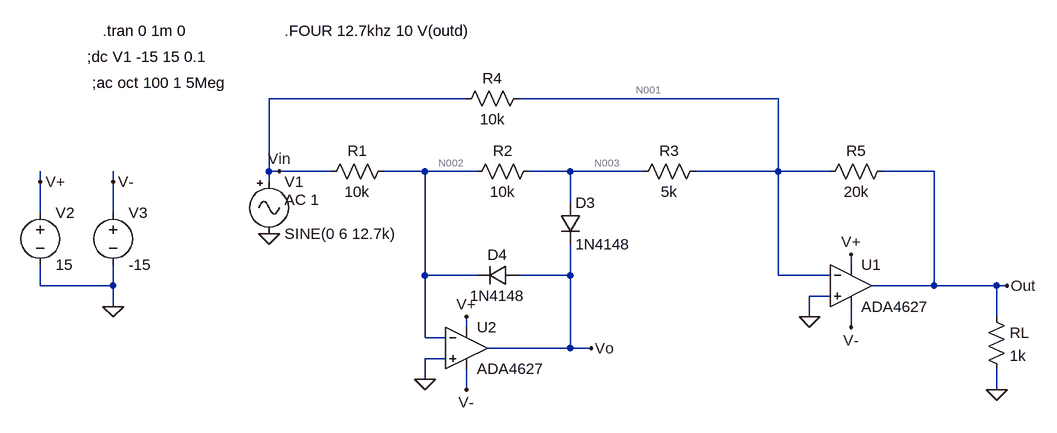
[diagram p0: schematic redresor.asc]
redresor.asc, the LTspice schematic file:
Version 4
SHEET 1 956 680
WIRE 0 -416 -304 -416
WIRE 480 -416 80 -416
WIRE -304 -304 -304 -416
WIRE -288 -304 -304 -304
WIRE -208 -304 -288 -304
WIRE -64 -304 -128 -304
WIRE 16 -304 -64 -304
WIRE 160 -304 96 -304
WIRE 272 -304 160 -304
WIRE 480 -304 480 -416
WIRE 480 -304 352 -304
WIRE 560 -304 480 -304
WIRE 720 -304 640 -304
WIRE -656 -288 -656 -304
WIRE -544 -288 -544 -304
WIRE -304 -288 -304 -304
WIRE 160 -256 160 -304
WIRE -656 -240 -656 -288
WIRE -544 -240 -544 -288
WIRE 592 -160 592 -176
WIRE -64 -144 -64 -304
WIRE 16 -144 -64 -144
WIRE 160 -144 160 -192
WIRE 160 -144 80 -144
WIRE 480 -144 480 -304
WIRE 560 -144 480 -144
WIRE -656 -128 -656 -160
WIRE -544 -128 -544 -160
WIRE -544 -128 -656 -128
WIRE 720 -128 720 -304
WIRE 720 -128 624 -128
WIRE 816 -128 720 -128
WIRE 832 -128 816 -128
WIRE 560 -112 528 -112
WIRE -544 -96 -544 -128
WIRE 528 -80 528 -112
WIRE 816 -80 816 -128
WIRE 0 -64 0 -80
WIRE 592 -64 592 -96
WIRE -64 -48 -64 -144
WIRE -32 -48 -64 -48
WIRE 160 -32 160 -144
WIRE 160 -32 32 -32
WIRE 192 -32 160 -32
WIRE -32 -16 -64 -16
WIRE -64 16 -64 -16
WIRE 0 32 0 0
WIRE 816 32 816 0
FLAG 832 -128 Out
FLAG -544 -96 0
FLAG -656 -288 V+
FLAG -544 -288 V-
FLAG 592 -176 V+
FLAG 592 -64 V-
FLAG 816 32 0
FLAG -64 16 0
FLAG 192 -32 Vo
FLAG 0 -80 V+
FLAG 0 32 V-
FLAG 528 -80 0
FLAG -288 -304 Vin
FLAG -304 -208 0
SYMBOL voltage -656 -256 R0
WINDOW 123 0 0 Left 2
WINDOW 39 0 0 Left 2
SYMATTR InstName V2
SYMATTR Value 15
SYMBOL voltage -544 -256 R0
WINDOW 123 0 0 Left 2
WINDOW 39 0 0 Left 2
SYMATTR InstName V3
SYMATTR Value -15
SYMBOL res 800 -96 R0
SYMATTR InstName RL
SYMATTR Value 1k
SYMBOL res -112 -320 R90
WINDOW 0 0 56 VBottom 2
WINDOW 3 32 56 VTop 2
SYMATTR InstName R1
SYMATTR Value 10k
SYMBOL res 96 -432 R90
WINDOW 0 0 56 VBottom 2
WINDOW 3 32 56 VTop 2
SYMATTR InstName R4
SYMATTR Value 10k
SYMBOL res 368 -320 R90
WINDOW 0 0 56 VBottom 2
WINDOW 3 32 56 VTop 2
SYMATTR InstName R3
SYMATTR Value 5k
SYMBOL res 656 -320 R90
WINDOW 0 0 56 VBottom 2
WINDOW 3 32 56 VTop 2
SYMATTR InstName R5
SYMATTR Value 20k
SYMBOL res 112 -320 R90
WINDOW 0 0 56 VBottom 2
WINDOW 3 32 56 VTop 2
SYMATTR InstName R2
SYMATTR Value 10k
SYMBOL diode 144 -256 R0
SYMATTR InstName D3
SYMATTR Value 1N4148
SYMBOL diode 80 -160 R90
WINDOW 0 0 32 VBottom 2
WINDOW 3 32 32 VTop 2
SYMATTR InstName D4
SYMATTR Value 1N4148
SYMBOL Misc\\signal -304 -304 R0
WINDOW 123 24 44 Left 2
WINDOW 39 0 0 Left 0
SYMATTR Value2 AC 1
SYMATTR InstName V1
SYMATTR Value SINE(0 6 12.7k)
SYMBOL OpAmps\\ADA4627 0 -96 R0
SYMATTR InstName U2
SYMBOL OpAmps\\ADA4627 592 -192 R0
SYMATTR InstName U1
TEXT -560 -520 Left 2 !.tran 0 1m 0
TEXT -584 -480 Left 2 !;dc V1 -15 15 0.1
TEXT -576 -440 Left 2 !;ac oct 100 1 5Meg
TEXT -280 -520 Left 2 !.FOUR 12.7khz 10 V(outd)

The netlist it stands for:
* redresor.asc
V2 V+ 0 15
V3 V- 0 -15
RL Out 0 1k
R1 N002 Vin 10k
R4 N001 Vin 10k
R3 N001 N003 5k
R5 Out N001 20k
R2 N003 N002 10k
D3 N003 Vo 1N4148
D4 Vo N002 1N4148
V1 Vin 0 SINE(0 6 12.7k) AC 1
XU2 0 N002 V+ V- Vo ADA4627  ; pins In+ In- V+ V- OUT
XU1 0 N001 V+ V- Out ADA4627  ; pins In+ In- V+ V- OUT
.model D D
.lib standard.dio
.tran 0 1m 0
;dc V1 -15 15 0.1
;ac oct 100 1 5Meg
.FOUR 12.7khz 10 V(outd)
.backanno
.end

* Results of the author's LTspice run, read from the files saved beside the schematic
* Operating Point, zero values left out:
*   V(v+) = 15 V
*   V(v-) = -15 V
*   V(out) = 188.5 µV
*   V(n002) = -291.5 µV
*   V(n001) = -292.3 µV
*   V(n003) = -558.8 µV
*   V(vo) = -158.7 mV
*   I(D3) = 80.01 nA
*   I(D4) = -2.444 nA
*   I(Rl) = 188.5 nA
*   I(R1) = -29.15 nA
*   I(R4) = -29.23 nA
*   I(R3) = 53.29 nA
*   I(R5) = 24.04 nA
*   I(R2) = -26.72 nA
*   I(V2) = -13.8 mA
*   I(V3) = 13.8 mA
*   I(V1) = -58.38 nA
*   Ix(u2:1) = -15.02 pA
*   Ix(u2:2) = -15.52 pA
*   Ix(u2:99) = 6.899 mA
*   Ix(u2:50) = -6.899 mA
*   Ix(u2:30) = 82.46 nA
*   Ix(u1:1) = -15.02 pA
*   Ix(u1:2) = -15.52 pA
*   Ix(u1:99) = 6.899 mA
*   Ix(u1:50) = -6.899 mA
*   Ix(u1:30) = -212.5 nA
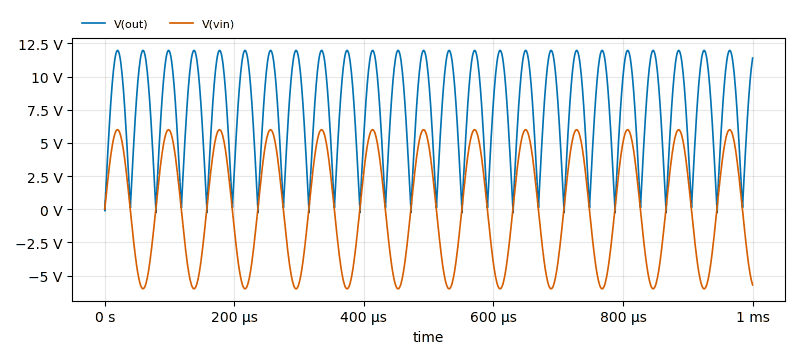
[diagram p1: Transient Analysis of redresor.asc, plotted from the saved traces]
* Transient Analysis, 1 run:
*   V(out): min -256.1 mV, max 11.98 V, average 7.605 V, rms 8.455 V, last 11.4 V
*   V(vin): min -6 V, max 6 V, average 98.36 mV, rms 4.234 V, last -5.706 V